# Altium schematic sheet TIA_signal_path_ADC.SchDoc
size B; SheetNumber: 2; SheetTotal: 9
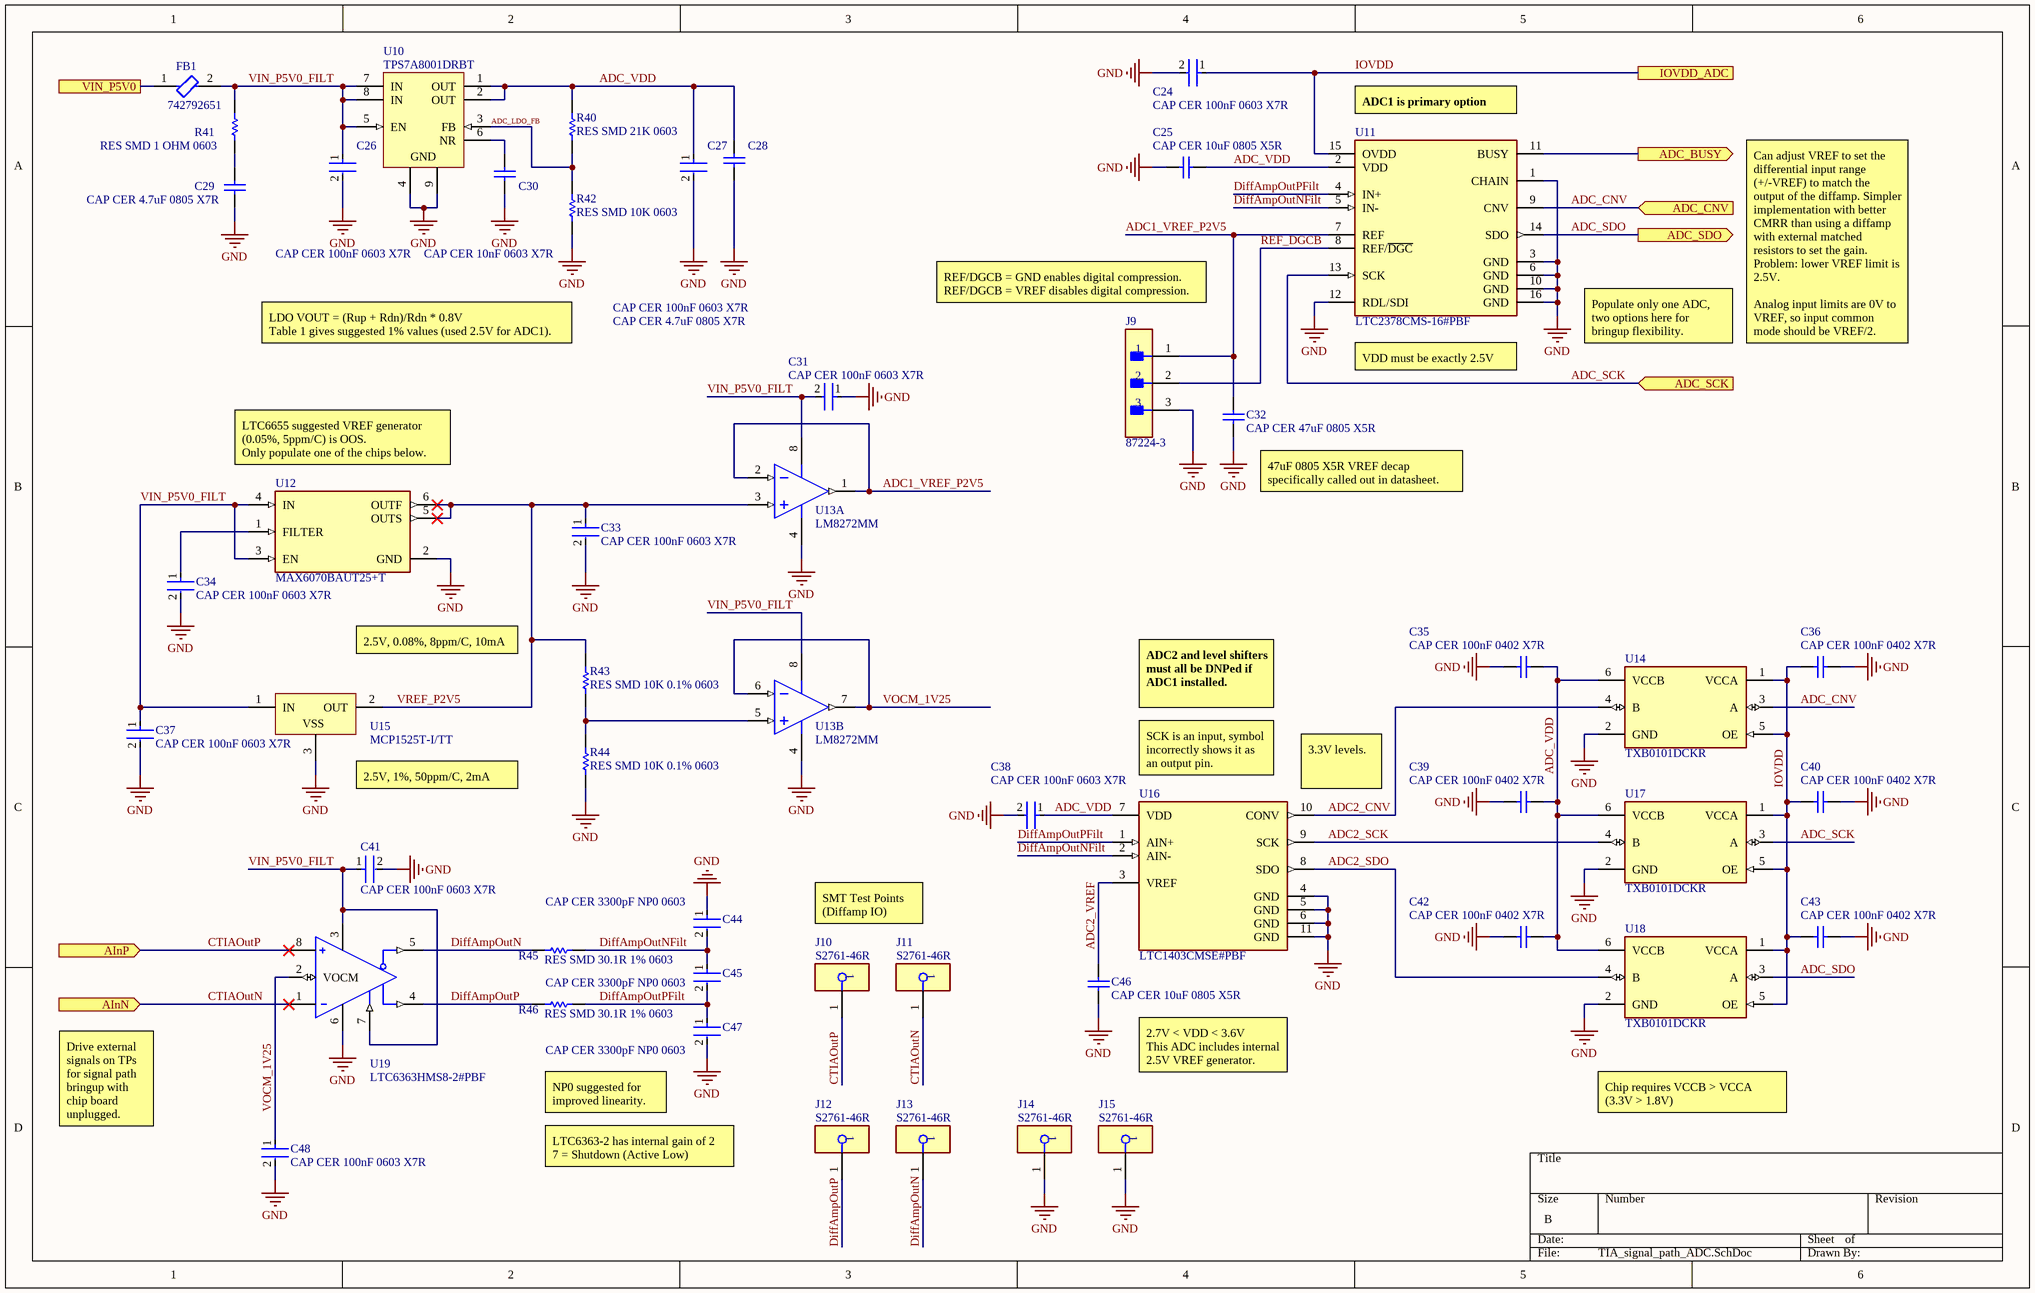
[diagram p0: TIA_signal_path_ADC.SchDoc]

## Parts
C24  CAP CER 100nF 0603 X7R  [FP-CC0603-DA-MFG]
C25  CAP CER 10uF 0805 X5R  [CAPC2013X140X50NL20T25]
C26  CAP CER 100nF 0603 X7R  [FP-CC0603-DA-MFG]
C27  CAP CER 100nF 0603 X7R  [FP-CC0603-DA-MFG]
C28  CAP CER 4.7uF 0805 X7R  [CAPC2013X140X50NL20T25]
C29  CAP CER 4.7uF 0805 X7R  [CAPC2013X140X50NL20T25]
C30  CAP CER 10nF 0603 X7R  [CAPC1608X90X40ML10T20]
C31  CAP CER 100nF 0603 X7R  [FP-CC0603-DA-MFG]
C32  CAP CER 47uF 0805 X5R  [CAPC2013X140X50NL20T25]
C33  CAP CER 100nF 0603 X7R  [FP-CC0603-DA-MFG]
C34  CAP CER 100nF 0603 X7R  [FP-CC0603-DA-MFG]
C35  CAP CER 100nF 0402 X7R  [CAPC1050X55X23ML05T13]
C36  CAP CER 100nF 0402 X7R  [CAPC1050X55X23ML05T13]
C37  CAP CER 100nF 0603 X7R  [FP-CC0603-DA-MFG]
C38  CAP CER 100nF 0603 X7R  [FP-CC0603-DA-MFG]
C39  CAP CER 100nF 0402 X7R  [CAPC1050X55X23ML05T13]
C40  CAP CER 100nF 0402 X7R  [CAPC1050X55X23ML05T13]
C41  CAP CER 100nF 0603 X7R  [FP-CC0603-DA-MFG]
C42  CAP CER 100nF 0402 X7R  [CAPC1050X55X23ML05T13]
C43  CAP CER 100nF 0402 X7R  [CAPC1050X55X23ML05T13]
C44  CAP CER 3300pF NP0 0603  [FP-CC0603-DA-MFG]
C45  CAP CER 3300pF NP0 0603  [FP-CC0603-DA-MFG]
C46  CAP CER 10uF 0805 X5R  [CAPC2013X140X50NL20T25]
C47  CAP CER 3300pF NP0 0603  [FP-CC0603-DA-MFG]
C48  CAP CER 100nF 0603 X7R  [FP-CC0603-DA-MFG]
FB1  742792651  [FP-742792651-MFG]
J9  87224-3  [FP-87224-3-MFG]
J10  S2761-46R  [FP-S2761-46R-MFG]
J11  S2761-46R  [FP-S2761-46R-MFG]
J12  S2761-46R  [FP-S2761-46R-MFG]
J13  S2761-46R  [FP-S2761-46R-MFG]
J14  S2761-46R  [FP-S2761-46R-MFG]
J15  S2761-46R  [FP-S2761-46R-MFG]
R40  RES SMD 21K 0603  [RESC1609X50X30LL10T20]
R41  RES SMD 1 OHM 0603  [RESC1609X50X30LL10T20]
R42  RES SMD 10K 0603  [RESC1609X50X30LL10T20]
R43  RES SMD 10K 0.1% 0603  [RESC1609X50X30LL10T20]
R44  RES SMD 10K 0.1% 0603  [RESC1609X50X30LL10T20]
R45  RES SMD 30.1R 1% 0603  [RESC1609X50X30LL10T20]
R46  RES SMD 30.1R 1% 0603  [RESC1609X50X30LL10T20]
U10  TPS7A8001DRBT  [DRB0008A_V]
U11  LTC2378CMS-16#PBF  [FP-MS-16-05-08-1669-IPC_B]
U12  MAX6070BAUT25+T  [FP-U6-5-MFG]
U13  LM8272MM  [DGK0008A_L]  (parts A,B of 2)
U14  TXB0101DCKR  [FP-DCK0006A-MFG]
U15  MCP1525T-I/TT  [SOT-23-TT3_M]
U16  LTC1403CMSE#PBF  [FP-MSE-10-05-08-1664-IPC_B]
U17  TXB0101DCKR  [FP-DCK0006A-MFG]
U18  TXB0101DCKR  [FP-DCK0006A-MFG]
U19  LTC6363HMS8-2#PBF  [FP-MS8-8-05-08-1660-IPC_A]

## Ports
ADC_BUSY (out), ADC_CNV (in), ADC_SCK (in), ADC_SDO (out), AInN (in), AInP (in), IOVDD_ADC, VIN_P5V0

## Nets
GND: C24.2 C25.1 C26.2 C27.2 C28.2 C29.2 C30.2 C31.1 C32.2 C33.2 C34.2 C35.2 C36.2 C37.2 C38.2 C39.2 C40.2 C41.2 C42.2 C43.2 C44.1 C46.1 C47.2 C48.2 J9.3 J14.1 J15.1 R42.1 R44.1 U10.4(GND) U10.9(GND) U11.1(CHAIN) U11.3(GND) U11.6(GND) U11.10(GND) U11.12(RDL/SDI) U11.16(GND) U12.2(GND) U13.4(V-) U14.2(GND) U15.3(VSS) U16.4(GND) U16.5(GND) U16.6(GND) U16.11(GND) U17.2(GND) U18.2(GND) U19.6(V-)
ADC1_VREF_P2V5: C32.1 J9.1 U11.7(REF) U13.1(OUTA) U13.2(INA-)
ADC2_CNV: U14.4(B) U16.10(CONV)
ADC2_SCK: U16.9(SCK) U17.4(B)
ADC2_SDO: U16.8(SDO) U18.4(B)
ADC2_VREF: C46.2 U16.3(VREF)
ADC_BUSY: U11.11(BUSY) ; port ADC_BUSY
ADC_CNV: U11.9(CNV) U14.3(A) ; port ADC_CNV
ADC_LDO_FB: R40.1 R42.2 U10.3(FB)
ADC_SCK: U11.13(SCK) U17.3(A) ; port ADC_SCK
ADC_SDO: U11.14(SDO) U18.3(A) ; port ADC_SDO
ADC_VDD: C25.2 C27.1 C28.1 C35.1 C38.1 C39.1 C42.1 R40.2 U10.1(OUT) U10.2(OUT) U11.2(VDD) U14.6(VCCB) U16.7(VDD) U17.6(VCCB) U18.6(VCCB)
CTIAOutN: J11.1 U19.1(-IN) ; port AInN
CTIAOutP: J10.1 U19.8(+IN) ; port AInP
DiffAmpOutN: J13.1 R45.2 U19.5(-OUT)
DiffAmpOutNFilt: C44.2 C45.1 R45.1 U11.5(IN-) U16.2(AIN-)
DiffAmpOutP: J12.1 R46.2 U19.4(+OUT)
DiffAmpOutPFilt: C45.2 C47.1 R46.1 U11.4(IN+) U16.1(AIN+)
IOVDD: C24.1 C36.1 C40.1 C43.1 U11.15(OVDD) U14.1(VCCA) U14.5(OE) U17.1(VCCA) U17.5(OE) U18.1(VCCA) U18.5(OE) ; port IOVDD_ADC
REF_DGCB: J9.2 U11.8(REF/~{DGC})
VIN_P5V0: FB1.1 ; port VIN_P5V0
VIN_P5V0_FILT: C26.1 C31.2 C37.1 C41.1 FB1.2 R41.2 U10.5(EN) U10.7(IN) U10.8(IN) U12.3(EN) U12.4(IN) U13.8(V+) U15.1(IN) U19.3(V+) U19.7(~{SHDN})
VOCM_1V25: C48.1 U13.6(INB-) U13.7(OUTB) U19.2(VOCM)
VREF_P2V5: C33.1 R43.2 U12.5(OUTS) U12.6(OUTF) U13.3(INA+) U15.2(OUT)
NetC29_1: C29.1 R41.1
NetC30_1: C30.1 U10.6(NR)
NetC34_1: C34.1 U12.1(FILTER)
NetR43_1: R43.1 R44.2 U13.5(INB+)

## Notes on the sheet
- (near U11) ADC1 is primary option
- REF/DGCB = GND enables digital compression.
  REF/DGCB = VREF disables digital compression.
- LDO VOUT = (Rup + Rdn)/Rdn * 0.8V
  Table 1 gives suggested 1% values (used 2.5V for ADC1).
- (near U11) VDD must be exactly 2.5V
- Populate only one ADC, two options here for bringup flexibility.
- Can adjust VREF to set the differential input range (+/-VREF) to match the output of the diffamp. Simpler implementation with better CMRR than using a diffamp with external matched resistors to set the gain. Problem: lower VREF limit is 2.5V.
  Analog input limits are 0V to VREF, so input common mode should be VREF/2.
- (near U12) LTC6655 suggested VREF generator (0.05%, 5ppm/C) is OOS.
  Only populate one of the chips below.
- (near C32) 47uF 0805 X5R VREF decap specifically called out in datasheet.
- 2.5V, 0.08%, 8ppm/C, 10mA
- ADC2 and level shifters must all be DNPed if ADC1 installed.
- (near U16) SCK is an input, symbol incorrectly shows it as an output pin.
- (near U15) 2.5V, 1%, 50ppm/C, 2mA
- (near U16) 3.3V levels.
- SMT Test Points
  (Diffamp IO)
- NP0 suggested for improved linearity.
- (near C46) 2.7V < VDD < 3.6V
  This ADC includes internal 2.5V VREF generator.
- Chip requires VCCB > VCCA
  (3.3V > 1.8V)
- Drive external signals on TPs for signal path bringup with chip board unplugged.
- LTC6363-2 has internal gain of 2
  7 = Shutdown (Active Low)

## Library data of the parts
C24 C26 C27 C31 C33 C34 C37 C38 C41 C48 = CMP-03422-000030-1: CAP CER 0.1UF 16V X7R 0603; Manufacturer Part Number: CC0603KRX7R7BB104; Manufacturer: YAGEO; Tolerance: 0.1; Temperature Coefficient: 15%; Material: Ceramic; Voltage Rating: 16 V; Package: CC0603-DA; ComponentLink2Description: Datasheet; Octopart: https://octopart.com/cc0603krx7r7bb104-yageo-192941; Temperature Range High: +125°C; Digikey Description: CAP CER 0.1UF 16V X7R 0603; Value: 100 nF; Voltage: 16 V; Device Class L2: Capacitors; Height: 0.9mm; Temperature: -55°C to +125°C; Device Class L1: Passive Components; Device Class L3: Ceramic Capacitors; ComponentLink2URL: http://www.yageo.com/documents/recent/UPY-GPHC_X7R_6.3V-to-50V_18.pdf; Footprint Url: http://www.yageo.com/exep/pages/download/literatures/UPY-C_GEN_24.pdf; RoHS: TRUE; Temperature Range Low: -55°C; Temperature Characteristic: X7R; Lead Free: Yes; Capacitance: 100 nF; Category: Cap; Mouser Description: Multilayer Ceramic Capacitor, CC Series, 0.1 - F, - 10%, X7R, 16 V, 0603 [1608 Metric]; Automotive: No
C25 C28 C29 C32 C46 = CMP-2007-04677-1: Part Number: 0805ZC475KAT2A; Manufacturer: AVX Interconnect / Elco
C30 = CMP-2100-03600-1: Chip Capacitor, 10 nF, +/- 10%, 50 V, -55 to 125 degC, 0603 (1608 Metric), RoHS, Tape and Reel; Manufacturer: Yageo; Insulation Resistance: 100GR; Voltage Rating (DC): 50V; Material: Ceramic; Lead Free: LeadFree; Case/Package: 0603; Datasheet Version: Rev. 15, 10/2016; Composition: Ceramic; Radiation Hardening: No; Thickness: 0.035inch; RoHSCompliant: True; Dielectric: X7R; Termination: SMD/SMT; Capacitance: 10nF; Manufacturer URL: http://www.yageo.com/; Tolerance: 10%; REACH SVHC: NoSVHC; Voltage: 50V; Max Operating Temperature: 125degC; Case Code (Metric): 1608; Package Quantity: 1; Case Code (Imperial): 0603; Packaging: TapeandReel; Package Reference: 0603; Width: 0.031inch; Datasheet URL: http://www.yageo.com/documents/recent/UPY-GPHC_X7R_6.3V-to-50V_15.pdf; Length: 1.6mm; Min Operating Temperature: -55degC; Number of Pins: 2; Depth: 0.8mm; Mount: SurfaceMount; Height: 0.8mm; Voltage Rating: 50V; Package Description: 2-Pin Surface Mount Device, Body 1.6 x 0.8 mm
C35 C36 C39 C40 C42 C43 = CMP-2000-05439-1: Chip Capacitor, 100 nF, +/- 10%, 16 V, -55 to 125 degC, 0402 (1005 Metric), RoHS, Tape and Reel; Manufacturer: Samsung Electro-Mechanics; Capacitance: 100000pF; Rated Voltage: 16V; Case Size/Dimension: 0402; Tolerance (%): ±10%; Manufacturer URL: http://www.samsungsem.com/global/index.jsp; Dielectric: X7R; Datasheet URL: https://datasheet.ciiva.com/29198/458718-da-01-en-vs-kondensator-0402-29198423.pdf; Datasheet Version: Nov-10
C44 C45 C47 = CMP-03422-000030-1: CAP CER 3300pF X7R 0603; Manufacturer Part Number: CC0603KRX7R7BB104; Manufacturer: YAGEO; Voltage Rating: 16 V; Tolerance: 0.1; Value: 100 nF; Temperature Coefficient: 15%; Material: Ceramic; Package: CC0603-DA; ComponentLink2Description: Datasheet; Octopart: https://octopart.com/cc0603krx7r7bb104-yageo-192941; Temperature Range High: +125°C; Digikey Description: CAP CER 0.1UF 16V X7R 0603; Voltage: 16 V; Device Class L2: Capacitors; Height: 0.9mm; Temperature: -55°C to +125°C; Device Class L1: Passive Components; Device Class L3: Ceramic Capacitors; ComponentLink2URL: http://www.yageo.com/documents/recent/UPY-GPHC_X7R_6.3V-to-50V_18.pdf; Footprint Url: http://www.yageo.com/exep/pages/download/literatures/UPY-C_GEN_24.pdf; RoHS: TRUE; Temperature Range Low: -55°C; Temperature Characteristic: X7R; Lead Free: Yes; Capacitance: 100 nF; Category: Cap; Mouser Description: Multilayer Ceramic Capacitor, CC Series, 0.1 - F, - 10%, X7R, 16 V, 0603 [1608 Metric]; Automotive: No
FB1 = CMP-0220-00181-2: FERRITE BEAD 600 OHM 0603 1LN; Tolerance: 25%; DC Resistance (DCR): 200mR; Inductance: 0.36H; Current Rating: 1A; Test Frequency: 100MHz; Impedance: 600R; Number of Lines: 1; Length: 1.6mm; Termination: SMD/SMT; Case Code (Metric): 1608; Case/Package: SMD/SMT; Min Operating Temperature: -55°C; Resistance: 200mR; Height: 0.8mm; Width: 0.8mm; Max Operating Temperature: 125°C; Package Quantity: 1; Mount: Surface Mount; Max DC Current: 1A; Max Current Rating: 1A; Weight: 0.000141oz; Packaging: Tape and Reel; Lead Free: Lead Free; Case Code (Imperial): 0603; Series: WE-CBF; Core Material: Ferrite; Material: Ferrite; RoHS Compliant: Yes; Depth: 0.8mm
J9 = CMP-2000-05697-2: CONN HEADER VERT 3POS 2.54MM; Number of Positions: 3; Gasket: No (Without); High Speed Serial Data Connector: No; Current Rating: 3A; Contact Post Length: 0.125inch; PCB Thickness: 1.397mm; PCB Mount Retention: Without; Connector Type: Plug; Approvals: CSA; PCB Mounting Orientation: Vertical; Pitch: 2.54mm; Mating Alignment: No (Without); Housing Color: Black; Contact Gender: Male; Length: 7.21mm; Max Operating Temperature: 105°C; Strain Relief: No (Without); Contact Material: Bronze; Row Spacing: 2.54mm; Series: AMPMODU MOD II; Board Standoff: No (Without); Package Quantity: 520; Radiation Hardening: No; Contact Protection: No (Without); Stabilizers: No (Without); Number of Rows: 1; Contact Mating Length: 8.08mm; Contact Shape: Square; Depth: 2.54mm; Contact Current Rating: 3A; Flammability Rating: UL94 V-0; Packaging: Carton; Number of Contacts: 3; Orientation: Straight; Mount: Through Hole; Keyed: No; Contact Type: Male Pin; Housing Material: Thermoplastic; High Temperature Housing: No; ELV: Compliant; Contact Plating: Gold; Termination: Through Hole; Selectively Loaded: No (Without); Lead Free: Lead Free; Min Operating Temperature: -65°C; Mating Connector Lock: No (Without); Color: Black; RoHS Compliant: Yes
J10-J15 = CMP-15817-000011-1: PC TEST POINT NATURAL; Body Material: Brass; Plating: Tin; Material: Copper Alloy; Mount: Surface Mount; Color: Natural; Packaging: Tape and Reel; RoHS Compliant: Yes
R40 R42-R46 = CMP-2000-03820-1: DNP; Part Number: CRCW0603100KFKEA; Manufacturer: Vishay Dale
R41 = CMP-2000-03820-1: Part Number: CRCW0603100KFKEA; Manufacturer: Vishay Dale
U10 = CMP-0395-00597-2: Single Output LDO, 1 A, Adjustable 0.8 to 6 V Output, 2.2 to 6.5 V Input, with High-Bandwidth PSRR, 8-pin SON (DRB), -40 to 125 degC, Green (RoHS & no Sb/Br); Manufacturer: Texas Instruments; Vin(Min)(V): 2.2; Iq(Typ)(mA): 0.04; Vout Adj(Max)(V): 6; SubFamily: Single Channel LDO; Accuracy(%): 3; Vin(Max)(V): 6.5; Vdo(Typ)(mV): 170; Vout Adj(Min)(V): 0.8; Iout(Max)(A): 1; PackageReference: DRB0008A; ComponentLink3URL: http://www.ti.com/litv/pdf/mpds118h; Eco-Plan: Green (RoHS & no Sb/Br); ComponentLink2Description: Datasheet; PackageVersion: 4203482-2/K; PackageDescription: 8-Pin Plastic Small Outline, Body 3 x 3 mm, Pitch 0.65 mm; ComponentLink2URL: http://www.ti.com/general/docs/lit/getliterature.tsp?genericPartNumber=TPS7A8001&fileType=pdf; ComponentLink1Description: Manufacturer URL; DatasheetVersion: SBVS135G; ComponentLink1URL: http://www.ti.com/; Mounting Technology: Surface Mount; PartNumber: TPS7A8001DRBT; ComponentLink3Description: Package Specification
U11 = CMP-09081-000147-1: IC ADC 16BIT SAR 16MSOP; Supply Current: 5.4mA; Max Supply Voltage: 2.625V; Min Supply Voltage: 2.375V; Resolution: 16b; Interface: SPI; Number of Converters: 1; Number of Bits: 16; Operating Supply Voltage: 2.5V; Supply Type: Analog; Integral Nonlinearity (INL): 0.5LSB; Polarity: Bipolar; Max Power Dissipation: 15.8mW; Sampling Rate: 1000000S/s; Min Operating Temperature: 0°C; Package Quantity: 37; Number of Pins: 16; REACH SVHC: No SVHC; Packaging: Rail/Tube; Mount: Surface Mount; Max Operating Temperature: 70°C; Case/Package: MSOP; RoHS Compliant: Yes; Nominal Supply Current: 5.4mA; Number of Elements: 1; Lead Free: Lead Free
U12 = CMP-05720-000007-1: IC VREF SERIES 0.04% SOT23-6; Output Current: 10mA; Max Input Voltage: 5.5V; Operating Supply Current: 300uA; Output Voltage: 3V; Number of Channels: 1; Quiescent Current: 235uA; Output Type: Fixed; Temperature Coefficient: 6ppm/°C; Min Input Voltage: 2.7V; Number of Pins: 6; Max Operating Temperature: 125°C; Packaging: Tape and Reel; Min Output Voltage: 3V; Case/Package: SOT-23-6; Tolerance: 0.04%; Reference Voltage: 3V; Min Operating Temperature: -40°C; Mount: Surface Mount; Package Quantity: 2500; Reference Type: Series
U13 = CMP-0055-01394-3: RRIO, High Output Current & Unlimited Cap Load Op Amp, 8-pin Mini SOIC; Manufacturer: Texas Instruments; CompType: Amplifiers; PowerWise: N; PackageTopMarking: ZXTT*A60; RoHS: N; ComponentLink1Description: Datasheet URL; PinCount: 8; Code_JEDEC: MO-187-AA; Package Reference: DGK0008A; ComponentLink1URL: http://www.ti.com/general/docs/lit/getliterature.tsp?genericPartNumber=LM8272&fileType=pdf; PackageDescription: MINI SOIC, .118 x .118 x .034in, 8 Lead, .0256in Pitch
U14 U17 U18 = CMP-04899-000110-1: IC TRNSLTR BIDIRECTIONAL SC70-6; Number of Bits: 1; Low Level Output Current: 20uA; Data Rate: 100Mbps; Logic Function: Translator; Min Supply Voltage: 1.2V; Turn-On Delay Time: 7.4ns; Propagation Delay: 31ns; High Level Output Current: -20uA; Max Supply Voltage: 5.5V; Series: -; Height: 1mm; Packaging: Tape and Reel; RoHS Compliant: Yes; Width: 1.4mm; Package Quantity: 1; Mount: Surface Mount; Case/Package: SC; Length: 2.15mm; Number of Pins: 6; Max Operating Temperature: 85°C; Contact Plating: Gold; Min Operating Temperature: -40°C; Radiation Hardening: No; Lead Free: Lead Free; Number of Inputs: 1; Number of Channels: 1; REACH SVHC: No SVHC
U15 = CMP-0131-00003-1: 2.5V Voltage Reference, 3-Pin SOT-23, Industrial Temperature, Tape and Reel; DatasheetVersion: revB, Feb-2005; Code_IPC: SOT23-3; PackageDescription: 3-Lead Plastic Small Outline Transistor (TT) [SOT-23]; PackageReference: SOT-23-TT3; PackageVersion: revBB, Aug-2009
U16 = CMP-09081-000219-1: IC ADC 12BIT SAR 10MSOP; Number of Bits: 12; Min Supply Voltage: 2.7V; Interface: SPI; Max Supply Voltage: 3.6V; Integral Nonlinearity (INL): 2LSB; Sampling Rate: 2800000S/s; Resolution: 12b; Max Power Dissipation: 12mW; Operating Supply Voltage: 3V; Number of Elements: 1; Power Dissipation: 100mW; Supply Type: Single; Nominal Supply Current: 4.7mA; Polarity: Unipolar; RoHS Compliant: Yes; Max Operating Temperature: 70°C; Lead Free: Lead Free; Packaging: Rail/Tube; Number of Pins: 10; Min Operating Temperature: 0°C; Package Quantity: 50; Mount: Surface Mount; Number of Converters: 1
U19 = CMP-09116-000200-1: IC OPAMP DIFF 1 CIRCUIT 8MSOP; RoHS Compliant: Yes